# Altium schematic sheet praline.SchDoc
size 297 x 209 mm
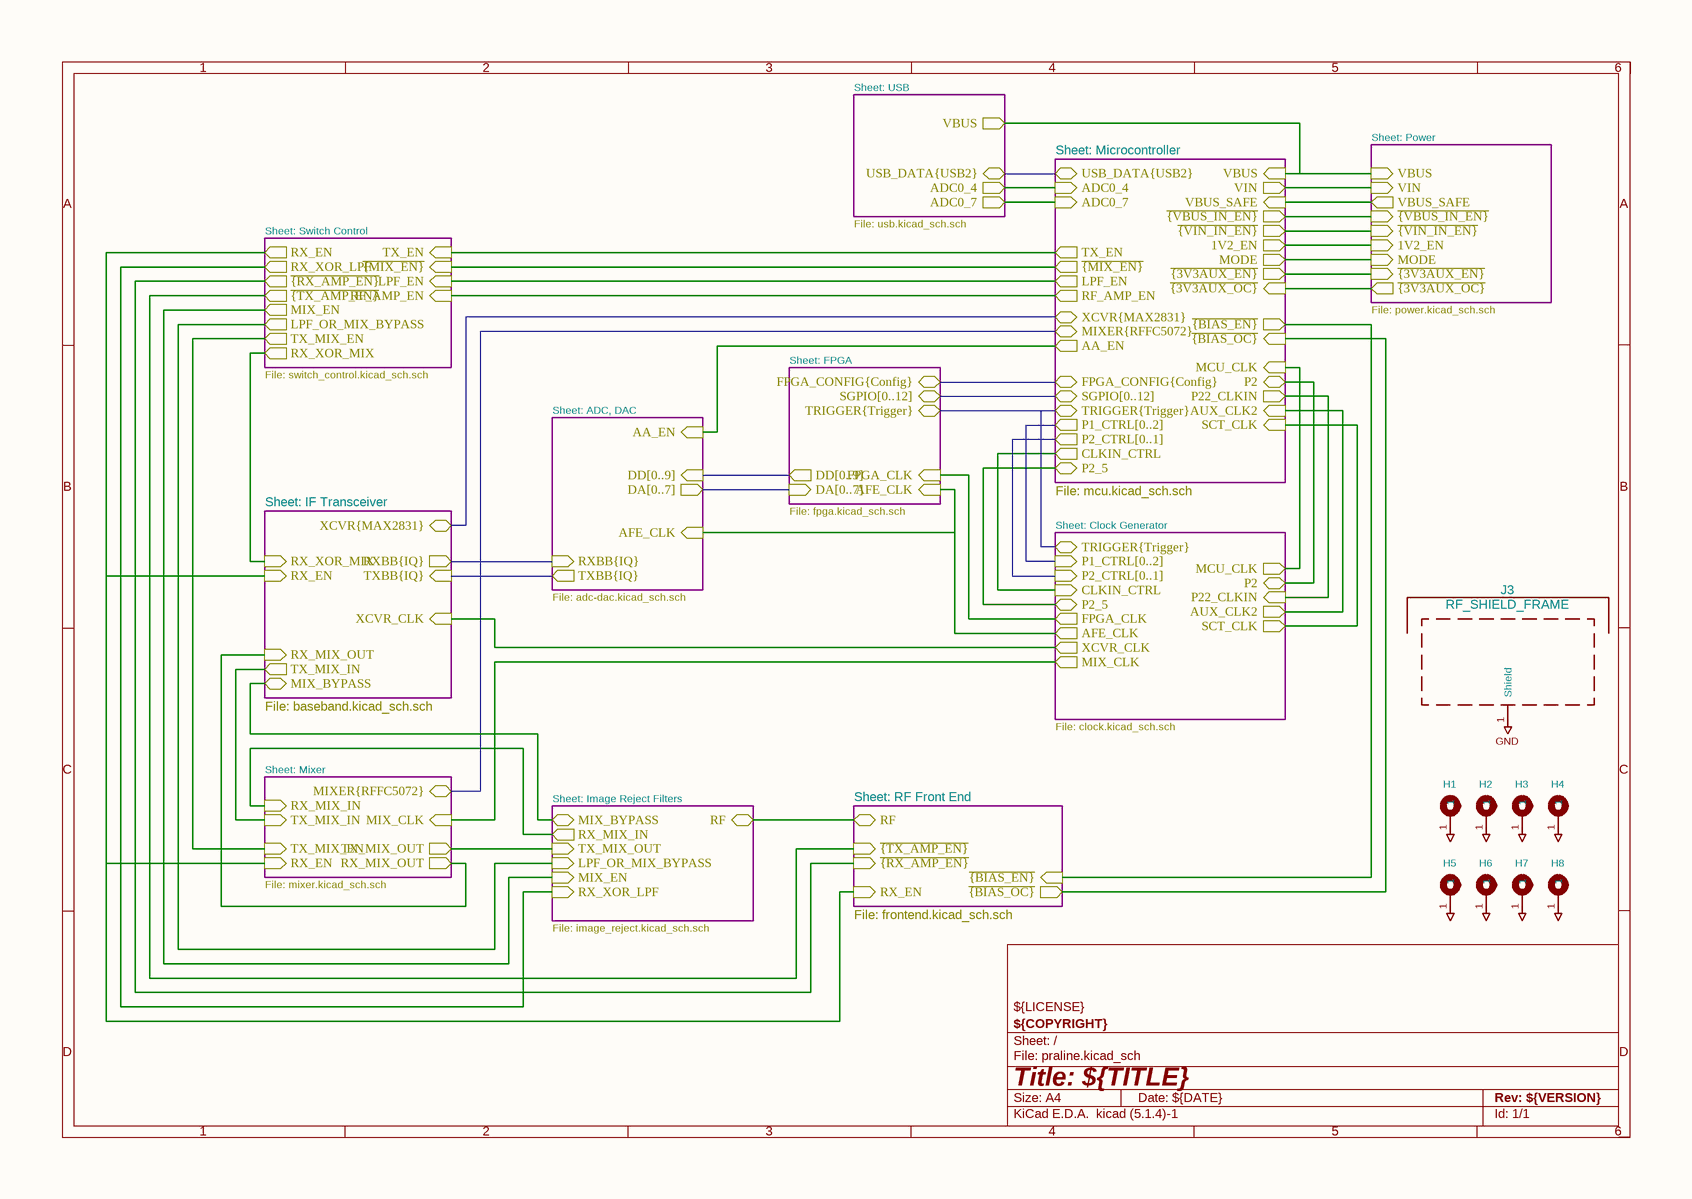
[diagram p0: praline.SchDoc]

## Parts
H1  MountingHole_Pad  [MountingHole_3.2mm_M3_Pad_Via]  (value not drawn)
H2  MountingHole_Pad  [MountingHole_3.2mm_M3_Pad_Via]  (value not drawn)
H3  MountingHole_Pad  [MountingHole_3.2mm_M3_Pad_Via]  (value not drawn)
H4  MountingHole_Pad  [MountingHole_3.2mm_M3_Pad_Via]  (value not drawn)
H5  MountingHole_Pad  [MountingHole_2.2mm_M2_Pad_Via]  (value not drawn)
H6  MountingHole_Pad  [MountingHole_2.2mm_M2_Pad_Via]  (value not drawn)
H7  MountingHole_Pad  [MountingHole_2.2mm_M2_Pad_Via]  (value not drawn)
H8  MountingHole_Pad  [MountingHole_2.2mm_M2_Pad_Via]  (value not drawn)
J3  RF_SHIELD_FRAME  [Laird_Technologies_BMI-S-230-F_50.8x38.1mm]

## Sub-sheets
ADC, DAC = adc-dac.SchDoc: DA[0..7] (out), DD[0..9] (in), RXBB{IQ} (in), TXBB{IQ} (out), AFE_CLK (in), AA_EN (in)
Clock Generator = clock.SchDoc: MCU_CLK (out), AFE_CLK (out), MIX_CLK (out), XCVR_CLK (out), TRIGGER{Trigger} (bidir), SCT_CLK (out), FPGA_CLK (out), P2_5 (bidir), AUX_CLK2 (out), P1_CTRL[0..2] (in), P22_CLKIN (in), P2_CTRL[0..1] (in), P2 (bidir), CLKIN_CTRL (in)
FPGA = fpga.SchDoc: SGPIO[0..12] (bidir), DD[0..9] (out), DA[0..7] (in), FPGA_CONFIG{Config} (bidir), AFE_CLK (in), TRIGGER{Trigger} (bidir), FPGA_CLK (in)
IF Transceiver = baseband.SchDoc: TXBB{IQ} (in), RXBB{IQ} (out), XCVR_CLK (in), XCVR{MAX2831} (bidir), RX_XOR_MIX (in), RX_EN (in), MIX_BYPASS (bidir), TX_MIX_IN (out), RX_MIX_OUT (in)
Image Reject Filters = image_reject.SchDoc: RX_MIX_IN (out), TX_MIX_OUT (in), MIX_BYPASS (bidir), RX_XOR_LPF (in), MIX_EN (in), LPF_OR_MIX_BYPASS (in), RF (bidir)
Microcontroller = mcu.SchDoc: SGPIO[0..12] (bidir), FPGA_CONFIG{Config} (bidir), MCU_CLK (in), 1V2_EN (out), VIN (out), VBUS_SAFE (in), ~{{VBUS_IN_EN}} (out), ~{{VIN_IN_EN}} (out), MODE (out), LPF_EN (out), RF_AMP_EN (out), TX_EN (out), ~{{MIX_EN}} (out), ~{{BIAS_EN}} (out), ~{{BIAS_OC}} (in), ~{{3V3AUX_EN}} (out), ~{{3V3AUX_OC}} (in), VBUS (in), USB_DATA{USB2} (bidir), XCVR{MAX2831} (bidir), TRIGGER{Trigger} (bidir), SCT_CLK (in), MIXER{RFFC5072} (bidir), AA_EN (out), P2_5 (bidir), AUX_CLK2 (in), P1_CTRL[0..2] (out), P22_CLKIN (out), P2_CTRL[0..1] (out), P2 (bidir), CLKIN_CTRL (out), ADC0_4 (in), ADC0_7 (in)
Mixer = mixer.SchDoc: MIX_CLK (in), RX_EN (in), RX_MIX_IN (in), TX_MIX_IN (in), RX_MIX_OUT (out), TX_MIX_OUT (out), MIXER{RFFC5072} (bidir), TX_MIX_EN (in)
Power = power.SchDoc: 1V2_EN (in), ~{{VBUS_IN_EN}} (in), VBUS (in), MODE (in), ~{{VIN_IN_EN}} (in), VIN (in), VBUS_SAFE (out), ~{{3V3AUX_EN}} (in), ~{{3V3AUX_OC}} (out)
RF Front End = frontend.SchDoc: ~{{TX_AMP_EN}} (in), ~{{BIAS_OC}} (out), ~{{RX_AMP_EN}} (in), ~{{BIAS_EN}} (in), RX_EN (in), RF (bidir)
Switch Control = switch_control.SchDoc: TX_EN (in), RX_EN (out), MIX_EN (out), RF_AMP_EN (in), LPF_EN (in), ~{{MIX_EN}} (in), RX_XOR_MIX (out), RX_XOR_LPF (out), ~{{TX_AMP_EN}} (out), ~{{RX_AMP_EN}} (out), LPF_OR_MIX_BYPASS (out), TX_MIX_EN (out)
USB = usb.SchDoc: VBUS (out), USB_DATA{USB2} (bidir), ADC0_4 (out), ADC0_7 (out)

## Nets
GND: H1.1 H2.1 H3.1 H4.1 H5.1 H6.1 H7.1 H8.1 J3.1(Shield)
(unnamed): sheet Microcontroller/MCU_CLK, sheet Clock Generator/MCU_CLK
(unnamed): sheet Microcontroller/1V2_EN, sheet Power/1V2_EN
(unnamed): sheet Microcontroller/VIN, sheet Power/VIN
(unnamed): sheet Microcontroller/VBUS_SAFE, sheet Power/VBUS_SAFE
(unnamed): sheet Microcontroller/~{{VBUS_IN_EN}}, sheet Power/~{{VBUS_IN_EN}}
(unnamed): sheet Microcontroller/~{{VIN_IN_EN}}, sheet Power/~{{VIN_IN_EN}}
(unnamed): sheet Microcontroller/MODE, sheet Power/MODE
(unnamed): sheet Microcontroller/LPF_EN, sheet Switch Control/LPF_EN
(unnamed): sheet Microcontroller/RF_AMP_EN, sheet Switch Control/RF_AMP_EN
(unnamed): sheet Microcontroller/TX_EN, sheet Switch Control/TX_EN
(unnamed): sheet Microcontroller/~{{MIX_EN}}, sheet Switch Control/~{{MIX_EN}}
(unnamed): sheet Microcontroller/~{{BIAS_EN}}, sheet RF Front End/~{{BIAS_EN}}
(unnamed): sheet Microcontroller/~{{BIAS_OC}}, sheet RF Front End/~{{BIAS_OC}}
(unnamed): sheet Microcontroller/~{{3V3AUX_EN}}, sheet Power/~{{3V3AUX_EN}}
(unnamed): sheet Microcontroller/~{{3V3AUX_OC}}, sheet Power/~{{3V3AUX_OC}}
(unnamed): sheet Microcontroller/VBUS, sheet Power/VBUS, sheet USB/VBUS
(unnamed): sheet Microcontroller/SCT_CLK, sheet Clock Generator/SCT_CLK
(unnamed): sheet Microcontroller/AA_EN, sheet ADC, DAC/AA_EN
(unnamed): sheet Microcontroller/P2_5, sheet Clock Generator/P2_5
(unnamed): sheet Microcontroller/AUX_CLK2, sheet Clock Generator/AUX_CLK2
(unnamed): sheet Microcontroller/P22_CLKIN, sheet Clock Generator/P22_CLKIN
(unnamed): sheet Microcontroller/P2, sheet Clock Generator/P2
(unnamed): sheet Microcontroller/CLKIN_CTRL, sheet Clock Generator/CLKIN_CTRL
(unnamed): sheet Microcontroller/ADC0_4, sheet USB/ADC0_4
(unnamed): sheet Microcontroller/ADC0_7, sheet USB/ADC0_7
(unnamed): sheet IF Transceiver/XCVR_CLK, sheet Clock Generator/XCVR_CLK
(unnamed): sheet IF Transceiver/RX_XOR_MIX, sheet Switch Control/RX_XOR_MIX
(unnamed): sheet IF Transceiver/RX_EN, sheet RF Front End/RX_EN, sheet Mixer/RX_EN, sheet Switch Control/RX_EN
(unnamed): sheet IF Transceiver/MIX_BYPASS, sheet Image Reject Filters/MIX_BYPASS
(unnamed): sheet IF Transceiver/TX_MIX_IN, sheet Mixer/TX_MIX_IN
(unnamed): sheet IF Transceiver/RX_MIX_OUT, sheet Mixer/RX_MIX_OUT
(unnamed): sheet RF Front End/~{{TX_AMP_EN}}, sheet Switch Control/~{{TX_AMP_EN}}
(unnamed): sheet RF Front End/~{{RX_AMP_EN}}, sheet Switch Control/~{{RX_AMP_EN}}
(unnamed): sheet RF Front End/RF, sheet Image Reject Filters/RF
(unnamed): sheet ADC, DAC/AFE_CLK, sheet Clock Generator/AFE_CLK, sheet FPGA/AFE_CLK
(unnamed): sheet Mixer/MIX_CLK, sheet Clock Generator/MIX_CLK
(unnamed): sheet Mixer/RX_MIX_IN, sheet Image Reject Filters/RX_MIX_IN
(unnamed): sheet Mixer/TX_MIX_OUT, sheet Image Reject Filters/TX_MIX_OUT
(unnamed): sheet Mixer/TX_MIX_EN, sheet Switch Control/TX_MIX_EN
(unnamed): sheet Clock Generator/FPGA_CLK, sheet FPGA/FPGA_CLK
(unnamed): sheet Switch Control/MIX_EN, sheet Image Reject Filters/MIX_EN
(unnamed): sheet Switch Control/RX_XOR_LPF, sheet Image Reject Filters/RX_XOR_LPF
(unnamed): sheet Switch Control/LPF_OR_MIX_BYPASS, sheet Image Reject Filters/LPF_OR_MIX_BYPASS

## Buses and harness runs
bus sheet ADC, DAC/DA[0..7] = sheet FPGA/DA[0..7]
bus sheet ADC, DAC/DD[0..9] = sheet FPGA/DD[0..9]
bus sheet ADC, DAC/RXBB{IQ} = sheet IF Transceiver/RXBB{IQ}
bus sheet ADC, DAC/TXBB{IQ} = sheet IF Transceiver/TXBB{IQ}
bus sheet Clock Generator/P1_CTRL[0..2] = sheet Microcontroller/P1_CTRL[0..2]
bus sheet Clock Generator/P2_CTRL[0..1] = sheet Microcontroller/P2_CTRL[0..1]
bus sheet Clock Generator/TRIGGER{Trigger} = sheet FPGA/TRIGGER{Trigger} = sheet Microcontroller/TRIGGER{Trigger}
bus sheet FPGA/FPGA_CONFIG{Config} = sheet Microcontroller/FPGA_CONFIG{Config}
bus sheet FPGA/SGPIO[0..12] = sheet Microcontroller/SGPIO[0..12]
bus sheet IF Transceiver/XCVR{MAX2831} = sheet Microcontroller/XCVR{MAX2831}
bus sheet Microcontroller/MIXER{RFFC5072} = sheet Mixer/MIXER{RFFC5072}
bus sheet Microcontroller/USB_DATA{USB2} = sheet USB/USB_DATA{USB2}

## Notes on the sheet
- Sheet: USB
- Sheet: Power
- File: usb.kicad_sch.sch
- Sheet: Microcontroller
- Sheet: Switch Control
- File: switch_control.kicad_sch.sch
- Sheet: FPGA
- File: power.kicad_sch.sch
- Sheet: ADC, DAC
- Sheet: IF Transceiver
- File: fpga.kicad_sch.sch
- File: mcu.kicad_sch.sch
- Sheet: Clock Generator
- File: adc-dac.kicad_sch.sch
- File: baseband.kicad_sch.sch
- File: clock.kicad_sch.sch
- Sheet: Mixer
- Sheet: Image Reject Filters
- Sheet: RF Front End
- File: mixer.kicad_sch.sch
- File: image_reject.kicad_sch.sch
- File: frontend.kicad_sch.sch
- 1
- 2
- 3
- 4
- 5
- 6
- A
- B
- C
- ${LICENSE}
- D
- Title: ${TITLE}
- File: praline.kicad_sch
- Sheet: /
- ${COPYRIGHT}
- KiCad E.D.A.  kicad (5.1.4)-1
- Size: A4
- Date: ${DATE}
- Rev: ${VERSION}
- Id: 1/1

## Library data of the parts
H1-H8 = MountingHole_Pad: Description: Mounting Hole with connection; Value: MountingHole_Pad
  H1-H4: Footprint: praline:MountingHole_3.2mm_M3_Pad_Via
  H5-H8: Footprint: MountingHole:MountingHole_2.2mm_M2_Pad_Via
J3 = RFShield_TwoPieces: Manufacturer: TE Connectivity; Part Number: 2118732-2; Description: BOARD SHIELD 2INX1.5IN FRAME; Note: use with shield 2118731-2; Value: RF_SHIELD_FRAME; Footprint: praline:Laird_Technologies_BMI-S-230-F_50.8x38.1mm